# EAGLE design Apple1 (EAGLE 9.2.0)
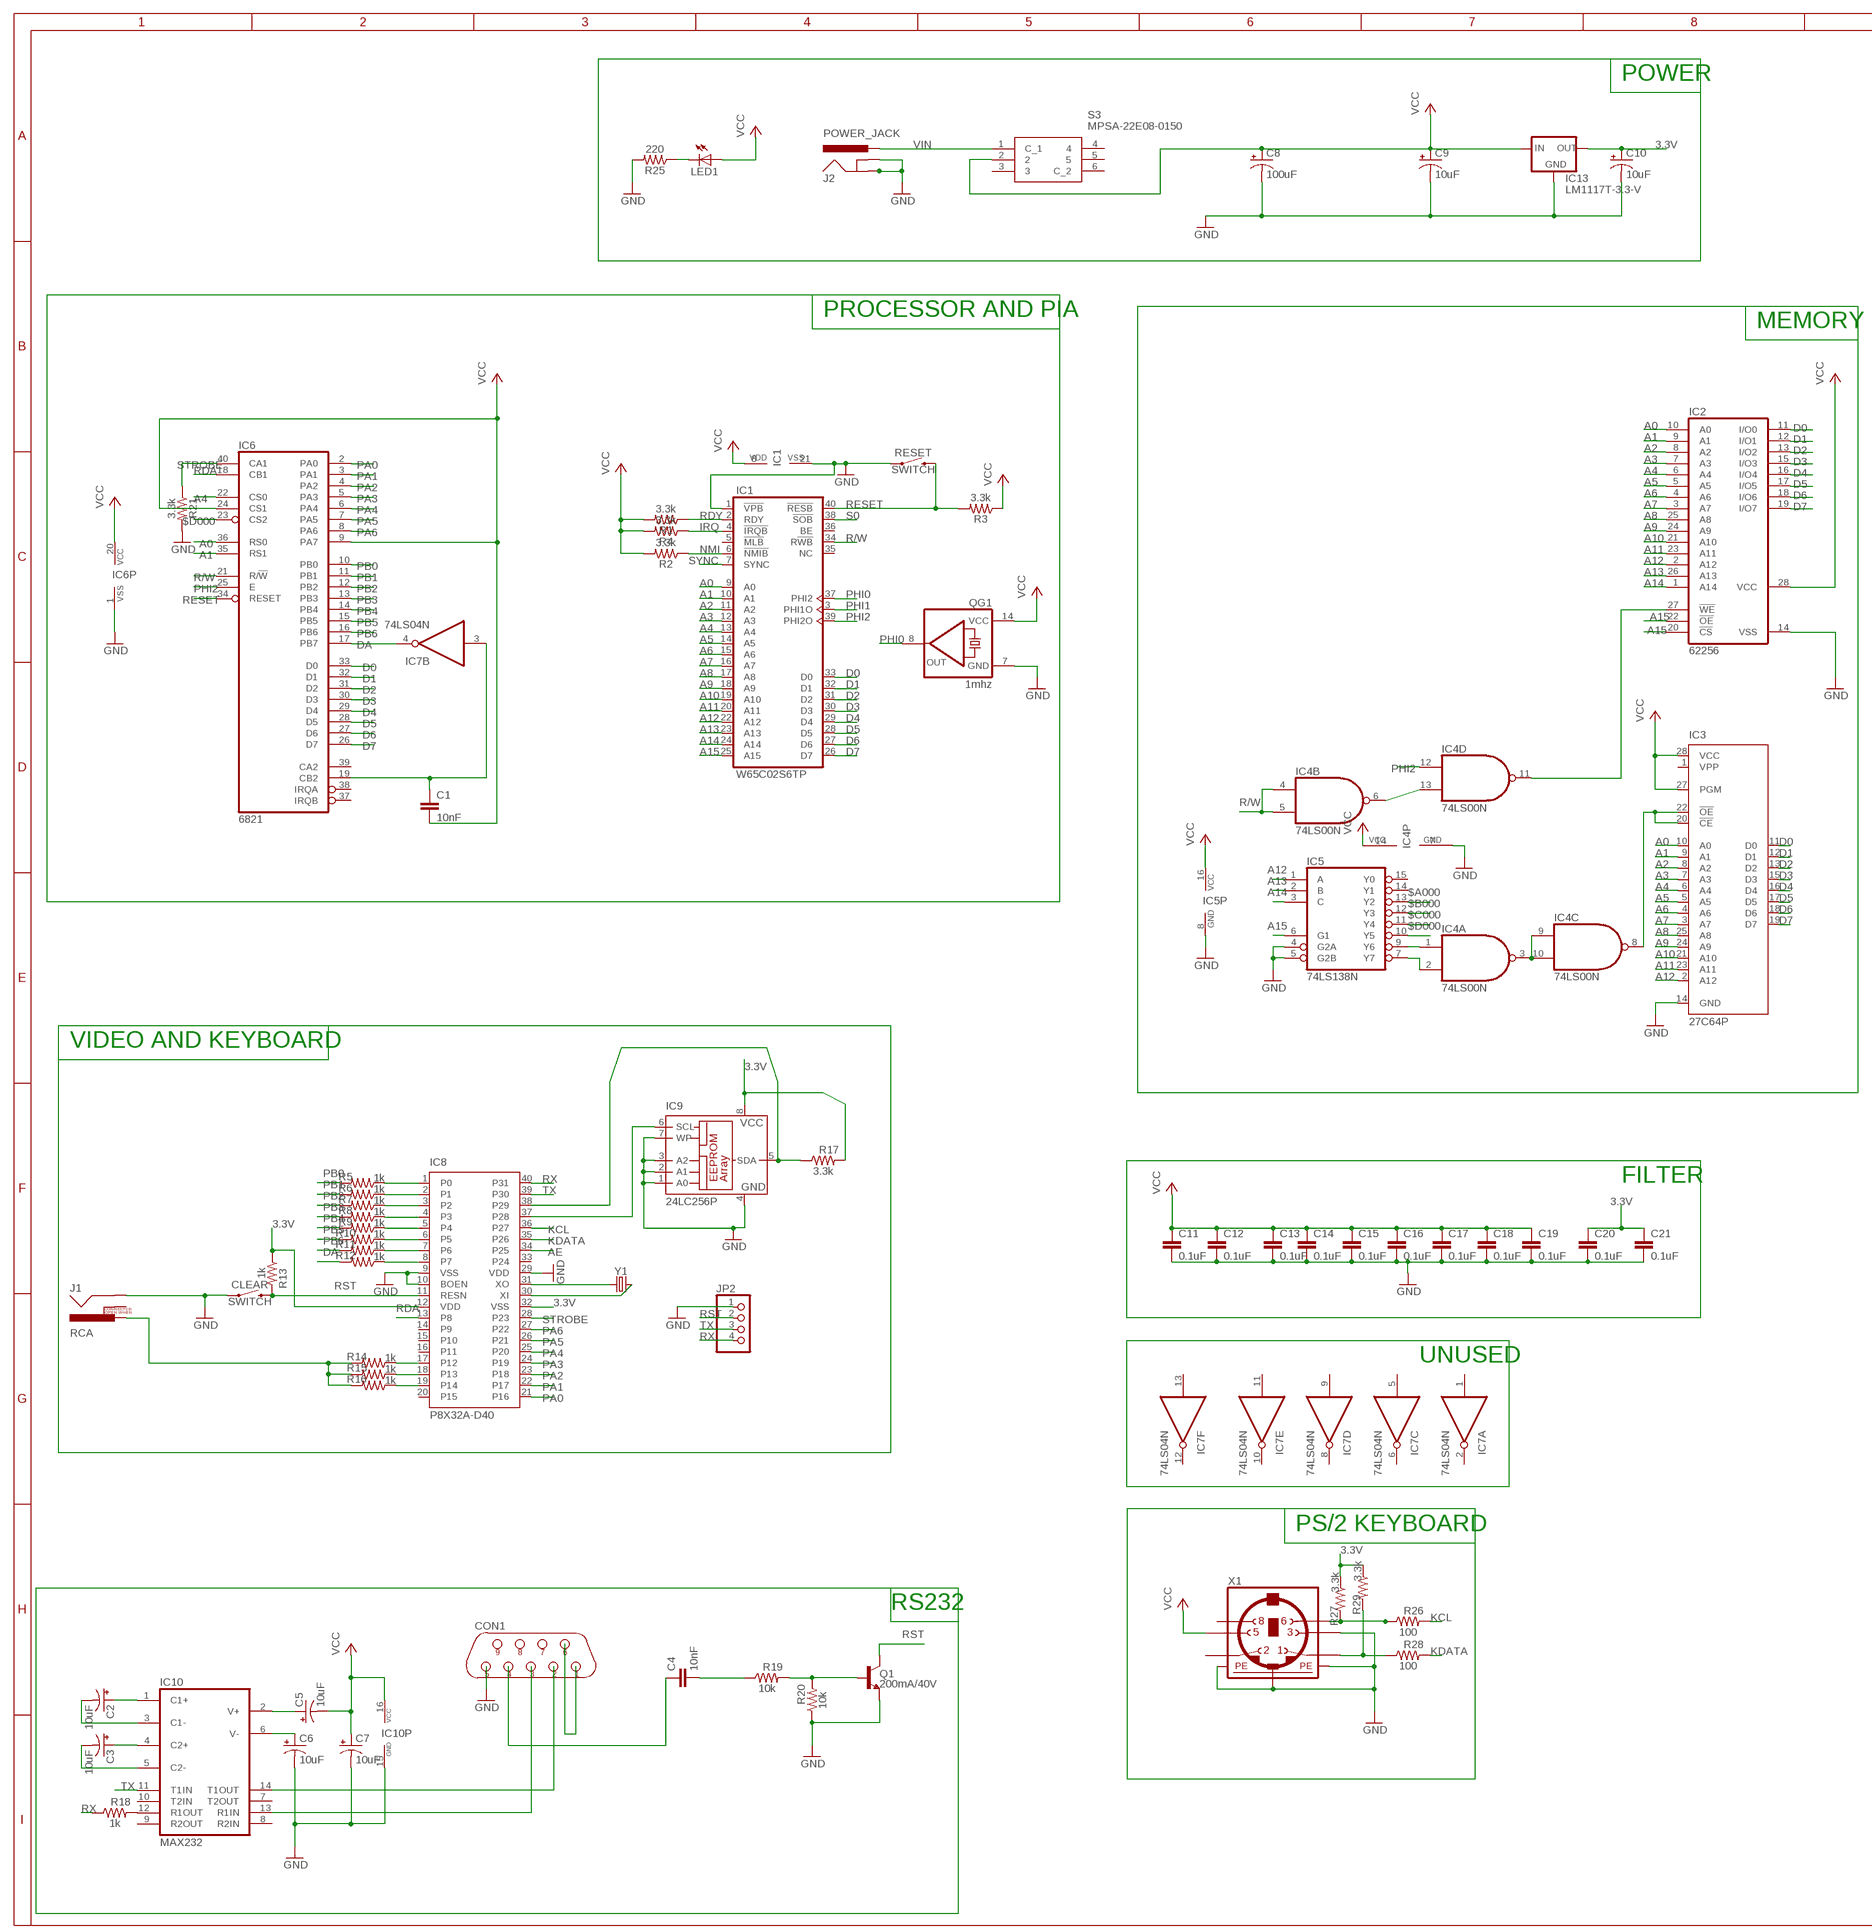
[diagram p0: schematic, sheet 1, part 1 of 2]
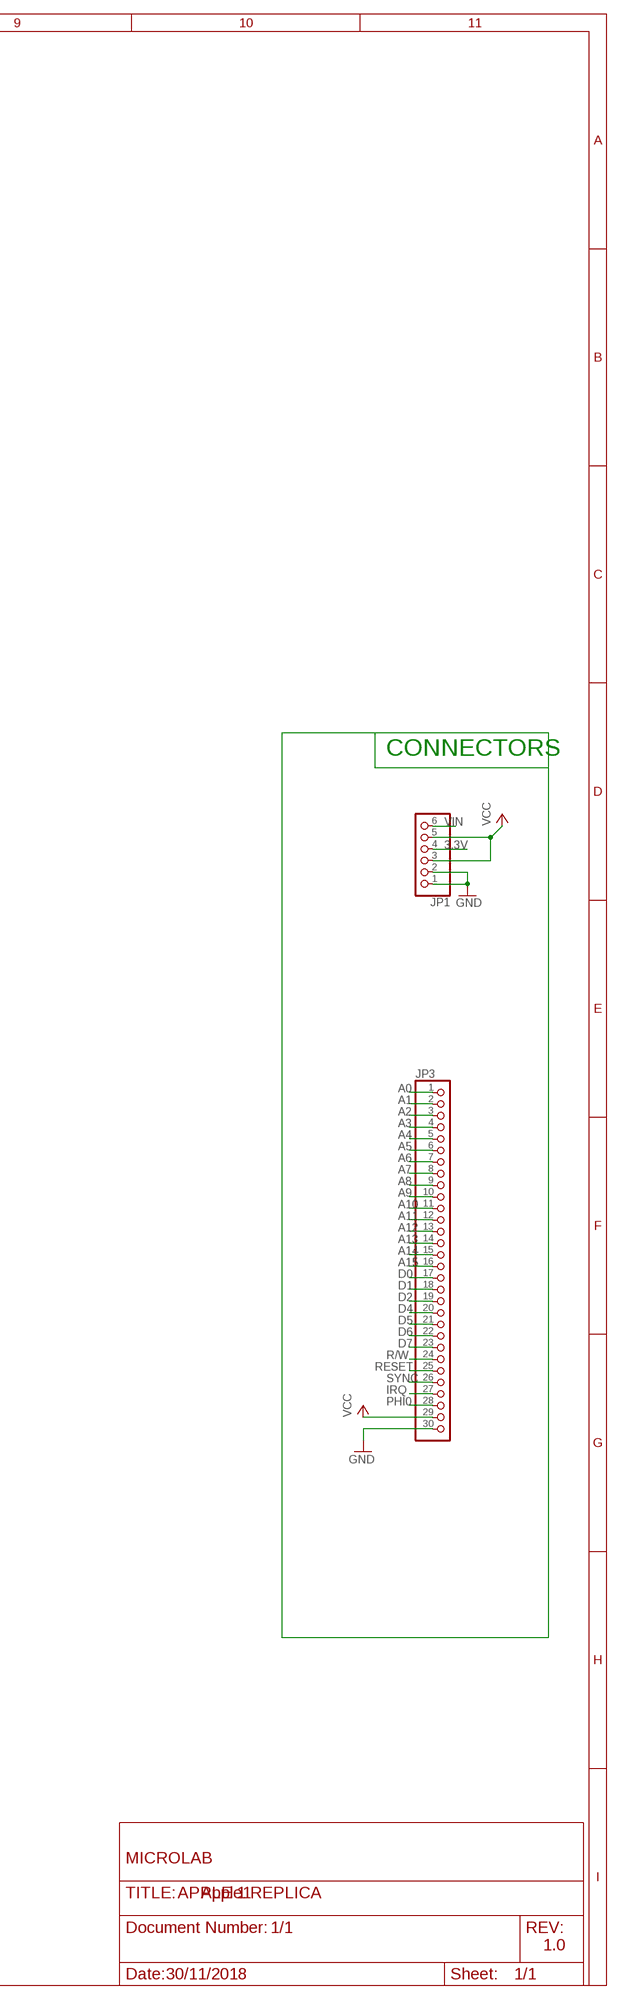
[diagram p1: schematic, sheet 1, part 2 of 2]

## Parts
C1  10nF  10NF-PTH-10MM-10000V-1-%  [CAP-PTH-10MM]
C2  10uF  10UF-POLAR-RADIAL-2.5MM-25V-20%  [CPOL-RADIAL-2.5MM-5MM]
C3  10uF  10UF-POLAR-RADIAL-2.5MM-25V-20%  [CPOL-RADIAL-2.5MM-5MM]
C4  10nF  10NF-PTH-10MM-10000V-1-%  [CAP-PTH-10MM]
C5  10uF  10UF-POLAR-RADIAL-2.5MM-25V-20%  [CPOL-RADIAL-2.5MM-5MM]
C6  10uF  10UF-POLAR-RADIAL-2.5MM-25V-20%  [CPOL-RADIAL-2.5MM-5MM]
C7  10uF  10UF-POLAR-RADIAL-2.5MM-25V-20%  [CPOL-RADIAL-2.5MM-5MM]
C8  100uF  100UF-POLAR-RADIAL-2.5MM-25V-20%  [CPOL-RADIAL-2.5MM-6.5MM]
C9  10uF  10UF-POLAR-RADIAL-2.5MM-25V-20%  [CPOL-RADIAL-2.5MM-5MM]
C10  10uF  10UF-POLAR-RADIAL-2.5MM-25V-20%  [CPOL-RADIAL-2.5MM-5MM]
C11  0.1uF  0.1UF-KIT-EZ-50V-20%  [CAP-PTH-SMALL-KIT]
C12  0.1uF  0.1UF-KIT-EZ-50V-20%  [CAP-PTH-SMALL-KIT]
C13  0.1uF  0.1UF-KIT-EZ-50V-20%  [CAP-PTH-SMALL-KIT]
C14  0.1uF  0.1UF-KIT-EZ-50V-20%  [CAP-PTH-SMALL-KIT]
C15  0.1uF  0.1UF-KIT-EZ-50V-20%  [CAP-PTH-SMALL-KIT]
C16  0.1uF  0.1UF-KIT-EZ-50V-20%  [CAP-PTH-SMALL-KIT]
C17  0.1uF  0.1UF-KIT-EZ-50V-20%  [CAP-PTH-SMALL-KIT]
C18  0.1uF  0.1UF-KIT-EZ-50V-20%  [CAP-PTH-SMALL-KIT]
C19  0.1uF  0.1UF-KIT-EZ-50V-20%  [CAP-PTH-SMALL-KIT]
C20  0.1uF  0.1UF-KIT-EZ-50V-20%  [CAP-PTH-SMALL-KIT]
C21  0.1uF  0.1UF-KIT-EZ-50V-20%  [CAP-PTH-SMALL-KIT]
CLEAR  SWITCH  MOMENTARY-SWITCH-SPST-PTH-6.0MM  [TACTILE_SWITCH_PTH_6.0MM]
CON1  DB9F  [D-09F]
IC1  W65C02S6TP  [DIL40]
IC2  62256  62256P  [DIL28-6]
IC3  27C64P  [DIL28-6]
IC4  74LS00N  [DIL14]
IC5  74LS138N  [DIL16]
IC6  6821  [DIL40]
IC7  74LS04N  [DIL14]
IC8  P8X32A-D40  [DIL40]
IC9  24LC256P  [DIL8]
IC10  MAX232  [DIL16]
IC13  LM1117T-3.3-V  [TO220V]
J1  RCA  [RCA]
J2  POWER_JACK  [POWER_JACK_PTH]
JP1  PINHD-1X6B  [1X06-BIG]
JP2  PINHD-1X4  [1X04]
JP3  PINHD-1X30  [1X30]
LED1  LED5MM  [LED5MM]
Q1  200mA/40V  TRANS_NPN-2N3904  [TO-92]
QG1  1mhz  QG5860  [DIL14S]
R1  3.3k  10KOHM-HORIZ-1/4W-5%  [AXIAL-0.3]
R2  3.3k  10KOHM-HORIZ-1/4W-5%  [AXIAL-0.3]
R3  3.3k  10KOHM-HORIZ-1/4W-5%  [AXIAL-0.3]
R4  3.3k  10KOHM-HORIZ-1/4W-5%  [AXIAL-0.3]
R5  1k  10KOHM-HORIZ-1/4W-5%  [AXIAL-0.3]
R6  1k  10KOHM-HORIZ-1/4W-5%  [AXIAL-0.3]
R7  1k  10KOHM-HORIZ-1/4W-5%  [AXIAL-0.3]
R8  1k  10KOHM-HORIZ-1/4W-5%  [AXIAL-0.3]
R9  1k  10KOHM-HORIZ-1/4W-5%  [AXIAL-0.3]
R10  1k  10KOHM-HORIZ-1/4W-5%  [AXIAL-0.3]
R11  1k  10KOHM-HORIZ-1/4W-5%  [AXIAL-0.3]
R12  1k  10KOHM-HORIZ-1/4W-5%  [AXIAL-0.3]
R13  1k  10KOHM-HORIZ-1/4W-5%  [AXIAL-0.3]
R14  1k  10KOHM-HORIZ-1/4W-5%  [AXIAL-0.3]
R15  1k  10KOHM-HORIZ-1/4W-5%  [AXIAL-0.3]
R16  1k  10KOHM-HORIZ-1/4W-5%  [AXIAL-0.3]
R17  3.3k  10KOHM-HORIZ-1/4W-5%  [AXIAL-0.3]
R18  1k  10KOHM-HORIZ-1/4W-5%  [AXIAL-0.3]
R19  10k  10KOHM-HORIZ-1/4W-5%  [AXIAL-0.3]
R20  10k  10KOHM-HORIZ-1/4W-5%  [AXIAL-0.3]
R21  3.3k  10KOHM-HORIZ-1/4W-5%  [AXIAL-0.3]
R25  220  10KOHM-HORIZ-1/4W-5%  [AXIAL-0.3]
R26  100  10KOHM-HORIZ-1/4W-5%  [AXIAL-0.3]
R27  3.3k  10KOHM-HORIZ-1/4W-5%  [AXIAL-0.3]
R28  100  10KOHM-HORIZ-1/4W-5%  [AXIAL-0.3]
R29  3.3k  10KOHM-HORIZ-1/4W-5%  [AXIAL-0.3]
RESET  SWITCH  MOMENTARY-SWITCH-SPST-PTH-6.0MM  [TACTILE_SWITCH_PTH_6.0MM]
S3  MPSA-22E08-0150  [MPSA22E080150]
X1  MINI_DIN_6  [M_DIN6]
Y1  CRYSTALPTH-HC49UV  [HC49U]

## Nets
3.3V [power]: C10.1(+) C20.1 C21.1 IC8.12(VDD) IC8.32(VSS) IC9.8(VCC) IC13.2(OUT) JP1.4 R13.P$1 R17.P$2 R27.P$1 R29.P$1
$A000: IC5.13(Y2)
$B000: IC5.12(Y3)
$C000: IC5.11(Y4)
$D000: IC5.10(Y5) IC6.23(CS2)
A0: IC1.9(1:A0) IC2.10(A0) IC3.10(A0) IC6.36(RS0) JP3.1
A1: IC1.10(1:A1) IC2.9(A1) IC3.9(A1) IC6.35(RS1) JP3.2
A2: IC1.11(1:A2) IC2.8(A2) IC3.8(A2) JP3.3
A3: IC1.12(1:A3) IC2.7(A3) IC3.7(A3) JP3.4
A4: IC1.13(1:A4) IC2.6(A4) IC3.6(A4) IC6.22(CS0) JP3.5
A5: IC1.14(1:A5) IC2.5(A5) IC3.5(A5) JP3.6
A6: IC1.15(1:A6) IC2.4(A6) IC3.4(A6) JP3.7
A7: IC1.16(1:A7) IC2.3(A7) IC3.3(A7) JP3.8
A8: IC1.17(1:A8) IC2.25(A8) IC3.25(A8) JP3.9
A9: IC1.18(1:A9) IC2.24(A9) IC3.24(A9) JP3.10
A10: IC1.19(1:A10) IC2.21(A10) IC3.21(A10) JP3.11
A11: IC1.20(1:A11) IC2.23(A11) IC3.23(A11) JP3.12
A12: IC1.22(1:A12) IC2.2(A12) IC3.2(A12) IC5.1(A) JP3.13
A13: IC1.23(1:A13) IC2.26(A13) IC5.2(B) JP3.14
A14: IC1.24(1:A14) IC2.1(A14) IC5.3(C) JP3.15
A15: IC1.25(1:A15) IC2.20(!CS) IC2.22(!OE) IC5.6(G1) JP3.16
AE: IC8.34(P25)
D0: IC1.33(1:D0) IC2.11(I/O0) IC3.11(D0) IC6.33(D0) JP3.17
D1: IC1.32(1:D1) IC2.12(I/O1) IC3.12(D1) IC6.32(D1) JP3.18
D2: IC1.31(1:D2) IC2.13(I/O2) IC3.13(D2) IC6.31(D2) JP3.19
D3: IC1.30(1:D3) IC2.15(I/O3) IC3.15(D3) IC6.30(D3)
D4: IC1.29(1:D4) IC2.16(I/O4) IC3.16(D4) IC6.29(D4) JP3.20
D5: IC1.28(1:D5) IC2.17(I/O5) IC3.17(D5) IC6.28(D5) JP3.21
D6: IC1.27(1:D6) IC2.18(I/O6) IC3.18(D6) IC6.27(D6) JP3.22
D7: IC1.26(1:D7) IC2.19(I/O7) IC3.19(D7) IC6.26(D7) JP3.23
DA: IC6.17(PB7) IC7.4(B:O) R12.P$2
GND [power]: C6.2(-) C7.2(-) C8.2(-) C9.2(-) C10.2(-) C11.2 C12.2 C13.2 C14.2 C15.2 C16.2 C17.2 C18.2 C19.2 C20.2 C21.2 CLEAR.1 CON1.5 IC1.1(1:!VPB) IC1.21(P:VSS) IC2.14(VSS) IC3.14(GND) IC4.7(P:GND) IC5.4(G2A) IC5.5(G2B) IC5.8(GND) IC6.1(VSS) IC8.9(VSS) IC8.10(BOEN) IC8.29(VDD) IC9.1(A0) IC9.2(A1) IC9.3(A2) IC9.4(GND) IC9.7(WP) IC10.15(GND) IC13.1(GND) J1.SHELL J2.GND J2.GNDBREAK JP1.1 JP1.2 JP2.1 JP3.30 Q1.1(E) QG1.7(GND) R20.P$1 R21.P$2 R25.P$2 RESET.1 X1.3 X1.SH1(PE1) X1.SH2(PE2) X1.SH3(PE3)
IRQ: IC1.4(1:!IRQB) JP3.27 R4.P$1
KCL: IC8.36(P27) R26.P$2
KDATA: IC8.35(P26) R28.P$2
N$1: IC2.27(!WE) IC4.11(D:O)
N$2: IC4.3(A:O) IC4.9(C:I0) IC4.10(C:I1)
N$3: IC3.20(!CE) IC3.22(!OE) IC4.8(C:O)
N$4: IC4.1(A:I0) IC5.9(Y6)
N$5: IC4.2(A:I1) IC5.7(Y7)
N$6: IC4.6(B:O) IC4.13(D:I1)
N$7: C1.1 IC6.19(CB2) IC7.3(B:I)
N$8: IC8.1(P0) R5.P$1
N$9: IC8.2(P1) R6.P$1
N$10: IC8.3(P2) R7.P$1
N$11: IC8.4(P3) R8.P$1
N$12: IC8.5(P4) R9.P$1
N$13: IC8.6(P5) R10.P$1
N$14: IC8.7(P6) R11.P$1
N$15: IC8.8(P7) R12.P$1
N$16: IC8.17(P12) R14.P$1
N$17: IC8.18(P13) R15.P$1
N$18: IC8.19(P14) R16.P$1
N$19: J1.PIN R14.P$2 R15.P$2 R16.P$2
N$20: IC8.31(XO) Y1.1
N$21: IC8.30(XI) Y1.2
N$22: IC10.12(R1OUT) R18.P$2
N$23: IC8.37(P28) IC9.6(SCL)
N$24: IC8.38(P29) IC9.5(SDA) R17.P$1
N$25: CON1.3 IC10.13(R1IN)
N$26: C2.1(+) IC10.1(C1+)
N$27: C2.2(-) IC10.3(C1-)
N$28: C3.1(+) IC10.4(C2+)
N$29: C3.2(-) IC10.5(C2-)
N$30: CON1.2 IC10.14(T1OUT)
N$31: CON1.1 CON1.6
N$32: C4.1 CON1.4
N$33: C4.2 R19.P$1
N$34: Q1.2(B) R19.P$2 R20.P$2
N$35: C5.1(+) IC10.2(V+)
N$36: C6.1(+) IC10.6(V-)
N$41: LED1.K(C) R25.P$1
N$42: R26.P$1 R27.P$2 X1.6
N$44: R28.P$1 R29.P$2 X1.1
NMI: IC1.6(1:!NMIB) R2.P$1
PA0: IC6.2(PA0) IC8.21(P16)
PA1: IC6.3(PA1) IC8.22(P17)
PA2: IC6.4(PA2) IC8.23(P18)
PA3: IC6.5(PA3) IC8.24(P19)
PA4: IC6.6(PA4) IC8.25(P20)
PA5: IC6.7(PA5) IC8.26(P21)
PA6: IC6.8(PA6) IC8.27(P22)
PB0: IC6.10(PB0) R5.P$2
PB1: IC6.11(PB1) R6.P$2
PB2: IC6.12(PB2) R7.P$2
PB3: IC6.13(PB3) R8.P$2
PB4: IC6.14(PB4) R9.P$2
PB5: IC6.15(PB5) R10.P$2
PB6: IC6.16(PB6) R11.P$2
PHI0: IC1.37(1:PHI2) JP3.28 QG1.8(OUT)
PHI1: IC1.3(1:PHI1O)
PHI2: IC1.39(1:PHI2O) IC4.12(D:I0) IC6.25(E)
R/W: IC1.34(1:R!WB) IC4.4(B:I0) IC4.5(B:I1) IC6.21(R/!W) JP3.24
RDA: IC6.18(CB1) IC8.13(P8)
RDY: IC1.2(1:RDY) R1.P$1
RESET: IC1.40(1:!RESB) IC6.34(RESET) JP3.25 R3.P$2 RESET.3
RST: CLEAR.3 IC8.11(RESN) JP2.2 Q1.3(C) R13.P$2
RX: IC8.40(P31) JP2.4 R18.P$1
S0: IC1.38(1:!SOB)
STROBE: IC6.40(CA1) IC8.28(P23) R21.P$1
SYNC: IC1.7(1:SYNC) JP3.26
TX: IC8.39(P30) IC10.11(T1IN) JP2.3
VCC [power]: C1.2 C5.2(-) C7.1(+) C8.1(+) C9.1(+) C11.1 C12.1 C13.1 C14.1 C15.1 C16.1 C17.1 C18.1 C19.1 IC1.8(P:VDD) IC2.28(VCC) IC3.27(PGM) IC3.28(VCC) IC4.14(P:VCC) IC5.16(VCC) IC6.9(PA7) IC6.20(VCC) IC6.24(CS1) IC10.16(VCC) IC13.3(IN) JP1.3 JP1.5 JP3.29 LED1.A QG1.14(VCC) R1.P$2 R2.P$2 R3.P$1 R4.P$2 S3.2 X1.5
VIN [power]: J2.PWR JP1.6 S3.1(C_1)
Unconnected: CON1.7 CON1.8 CON1.9 IC1.5(1:!MLB) IC1.35(1:NC) IC1.36(1:BE) IC3.1(VPP) IC3.26(NC) IC5.14(Y1) IC5.15(Y0) IC6.37(IRQB) IC6.38(IRQA) IC6.39(CA2) IC7.1(A:I) IC7.2(A:O) IC7.5(C:I) IC7.6(C:O) IC7.8(D:O) IC7.9(D:I) IC7.10(E:O) IC7.11(E:I) IC7.12(F:O) IC7.13(F:I) IC8.14(P9) IC8.15(P10) IC8.16(P11) IC8.20(P15) IC8.33(P24) IC10.7(T2OUT) IC10.8(R2IN) IC10.9(R2OUT) IC10.10(T2IN) J1.SWITCH S3.3 S3.4 S3.5 S3.6(C_2) X1.2 X1.8

## Notes on the sheet
- POWER
- PROCESSOR AND PIA
- MEMORY
- CONNECTORS
- VIDEO AND KEYBOARD
- FILTER
- UNUSED
- PS/2 KEYBOARD
- RS232
- MICROLAB
- APPLE 1 REPLICA
- 1/1
- 1.0
- 30/11/2018

## Power pins joined to a net without a drawn wire
GND: IC7.7(P:GND)
VCC: IC7.14(P:VCC)

## Library data of the parts
C1 C4 = SparkFun-Capacitors:10NF: 0.01uF/10nF/10,000pF ceramic capacitors A capacitor is a passive two-terminal electrical component used to store electrical energy temporarily in an electric field. CAP-09321; PROD_ID: CAP-09321
C2 C3 C5-C7 C9 C10 = SparkFun-Capacitors:10UF-POLAR: 10.0µF polarized capacitors A capacitor is a passive two-terminal electrical component used to store electrical energy temporarily in an electric field.; PROD_ID: CAP-08440
C8 = SparkFun-Capacitors:100UF-POLAR: 100µF polarized capacitors A capacitor is a passive two-terminal electrical component used to store electrical energy temporarily in an electric field.; PROD_ID: CAP-08439
C11-C21 = SparkFun-Capacitors:0.1UF: 0.1µF ceramic capacitors A capacitor is a passive two-terminal electrical component used to store electrical energy temporarily in an electric field.; PROD_ID: CAP-08370
CLEAR RESET = SparkFun-Switches:MOMENTARY-SWITCH-SPST: Momentary Switch (Pushbutton) - SPST Normally-open (NO) SPST momentary switches (buttons, pushbuttons). Variants PTH-12MM - 12mm square, through-hole Momentary Pushbutton Switch - 12mm Square (COM-09190) PTH-6.0MM, PTH-6.0MM-KIT - 6.0mm square, through-hole Mini Pushbutton Switch (COM-00097) KIT package intended for soldering kit's - only one side of pads' copper is exposed. PTH-RIGHT-ANGLE-KIT - Right-angle, through-hole Right Angle Tactile Button - Used on SparkFun BigTime Watch Kit SMD-12MM - 12mm square, surface-mount Tactile Button - SMD (12mm) (COM-12993) Used on SparkFun PicoBoard SMD-4.5MM - 4.5mm Square Trackball Switch Used on SparkFun Blackberry Trackballer Breakout SMD-4.6MMX2.8MM - 4.60mm x 2.80mm, surface mount Used on SparkFun SAMD21 Mini Breakout SMD-5.2MM, SMD-5.2-REDUNDANT - 5.2mm square, surface-mount Mini Pushbutton Switch - SMD (COM-08720) Used on Arduino Pro Mini REDUNDANT package connects both switch circuits together SMD-6.0X3.5MM - 6.0 x 3.5mm, surface mount Momentary Reset Switch SMD (COM-08229) SMD-6.2MM-TALL - 6.2mm square, surface mount Tactile Button - SMD (6mm) Used on SparkFun Digital Sandbox SMD-RIGHT-ANGLE - Right-angle, surface mount Used on SparkFun Block for Intel® Edison - Arduino; PROD_ID: SWCH-08441; SF_SKU: COM-00097
CON1 = connect:DB9F
IC1 = 6502:W65C02S: W65C02 by WDC
IC2 = memory-hitachi:62256P: MEMORY; OC_FARNELL: unknown; OC_NEWARK: unknown
IC3 = microchip:27*64: CMOS EPROM 64 K (8 K x 8), low voltage; MF: Arrow Electronics; MPN: M27C64A-10F1; OC_FARNELL: 1094265; OC_NEWARK: 93K7339
IC4 = 74xx-us:74*00: Quad 2-input NAND gate
IC5 = 74xx-eu:74*138: 3-line to 8-line DECODER/DEMULTIPLEXER
IC6 = micro-motorola:6821: MICROCONTROLLER/MEMORY DEVICE; MF: NTE ELECTRONICS; MPN: NTE6821; OC_FARNELL: 1652403; OC_NEWARK: 29C4772
IC7 = 74xx-us:74*04: Hex INVERTER
IC8 = p8x32a_10:P8X32A-D40: 8-Cog Multiprocessor Microcontroller Source: http://www.parallax.com/sites/default/files/downloads/P8X32A-Propeller-Datasheet-v1.4.0_0.pdf; MF: Parallax Semiconductor; MPN: P8X32A-D40; OC_FARNELL: 1263886; OC_NEWARK: 11X5686
IC9 = microchip:24*: Serial EEPROM I2C; MF: MICROCHIP; MPN: 24LC256-E/P; OC_FARNELL: 9757970; OC_NEWARK: 92C7169
IC10 = maxim:MAX232: RS232 TRANSCEIVER; MF: MAXIM; MPN: MAX232ACPE+; OC_FARNELL: 9723773; OC_NEWARK: 68K4544
IC13 = lm1117:LM1117T-*
J1 = SparkFun-Connectors:RCA: RCA Jack connector This is a right angle RCA jack connecotr. Commonly used for video or audio. Here is the connector we sell at SparkFun: RCA Jack (PRT-08631) Datasheet It is not used on any active designs, however it was used on a couple retired products: RCA Jack Breakout [RETIRED] (PRT-08826) SparkFun On Screen Display Breakout - MAX7456 [RETIRED] (BOB-09168) You may also be interested in a cable: RCA Video Cable - 6' (CAB-11573); PROD_ID: CONN-09081; SF_ID: PRT-08631
J2 = SparkFun-Connectors:POWER_JACK: Power Jack Connector This is the standard 5.5mm barrel jack for power. The PTH is the most common, proven, reliable, footprint. The Slot footprint only works if the mill layer is transmitted to the PCB fab house so be warned. Here are the connectors we sell at SparkFun: DC Barrel Power Jack/Connector (PRT-00119) DC Barrel Power Jack/Connector (SMD) (PRT-12748) DC Barrel Jack Adapter - Breadboard Compatible (PRT-10811) It is used on this SparkFun product (and many, many others): SparkFun RedBoard - Programmed with Arduino (DEV-12757) Also, if you need a mating power supply or connector, please check these out: Wall Adapter Power Supply - 9VDC 650mA (TOL-00298) DC Barrel Jack Adapter - Male (PRT-10287); PROD_ID: CONN-08197
JP1 = adafruit:PINHD-1X6: PIN HEADER
JP2 = pinhead:PINHD-1X4: PIN HEADER
JP3 = pinhead:PINHD-1X30: PIN HEADER
LED1 = led:LED: LED OSRAM: - CHIPLED LG R971, LG N971, LY N971, LG Q971, LY Q971, LO R971, LY R971 LH N974, LH R974 LS Q976, LO Q976, LY Q976 LO Q996 - Hyper CHIPLED LW Q18S LB Q993, LB Q99A, LB R99A - SideLED LS A670, LO A670, LY A670, LG A670, LP A670 LB A673, LV A673, LT A673, LW A673 LH A674 LY A675 LS A676, LA A676, LO A676, LY A676, LW A676 LS A679, LY A679, LG A679 - Hyper Micro SIDELED® LS Y876, LA Y876, LO Y876, LY Y876 LT Y87S - SmartLED LW L88C, LW L88S LB L89C, LB L89S, LG L890 LS L89K, LO L89K, LY L89K LS L896, LA L896, LO L896, LY L896 - TOPLED LS T670, LO T670, LY T670, LG T670, LP T670 LSG T670, LSP T670, LSY T670, LOP T670, LYG T670 LG T671, LOG T671, LSG T671 LB T673, LV T673, LT T673, LW T673 LH T674 LS T676, LA T676, LO T676, LY T676, LB T676, LH T676, LSB T676, LW T676 LB T67C, LV T67C, LT T67C, LS T67K, LO T67K, LY T67K, LW E67C LS E67B, LA E67B, LO E67B, LY E67B, LB E67C, LV E67C, LT E67C LW T67C LS T679, LY T679, LG T679 LS T770, LO T770, LY T770, LG T770, LP T770 LB T773, LV T773, LT T773, LW T773 LH T774 LS E675, LA E675, LY E675, LS T675 LS T776, LA T776, LO T776, LY T776, LB T776 LHGB T686 LT T68C, LB T68C - Hyper Mini TOPLED® LB M676 - Mini TOPLED Santana® LG M470 LS M47K, LO M47K, LY M47K Source: http://www.osram.convergy.de LUXEON: - LUMILED® LXK2-PW12-R00, LXK2-PW12-S00, LXK2-PW14-U00, LXK2-PW14-V00 LXK2-PM12-R00, LXK2-PM12-S00, LXK2-PM14-U00 LXK2-PE12-Q00, LXK2-PE12-R00, LXK2-PE12-S00, LXK2-PE14-T00, LXK2-PE14-U00 LXK2-PB12-K00, LXK2-PB12-L00, LXK2-PB12-M00, LXK2-PB14-N00, LXK2-PB14-P00, LXK2-PB14-Q00 LXK2-PR12-L00, LXK2-PR12-M00, LXK2-PR14-Q00, LXK2-PR14-R00 LXK2-PD12-Q00, LXK2-PD12-R00, LXK2-PD12-S00 LXK2-PH12-R00, LXK2-PH12-S00 LXK2-PL12-P00, LXK2-PL12-Q00, LXK2-PL12-R00 Source: www.luxeon.com KINGBRIGHT: KA-3528ASYC Source: www.kingbright.com
Q1 = SparkFun-DiscreteSemi:TRANS_NPN: NPN transistor Current controlled devices typically used to amplify current or used as a switch. BC547 - COM-08928 (TO-92 45V 100mA) (1.Collector 2.Base 3.Emitter) 2N3904 - COM-00521 (TO-92 40V 200mA) (1.Emitter 2.Base 3.Collector) P2N2222A - COM-12852 (TO-92 40V 600mA) (1.Collector 2.Base 3.Emitter); PROD_ID: TRANS-08447
QG1 = crystal:QG5860: CRYSTAL RESONATOR; OC_FARNELL: unknown; OC_NEWARK: unknown
R1-R18 R21 R25-R29 = SparkFun-Resistors:10KOHM: 10kΩ resistor A resistor is a passive two-terminal electrical component that implements electrical resistance as a circuit element. Resistors act to reduce current flow, and, at the same time, act to lower voltage levels within circuits. - Wikipedia; PROD_ID: RES-09435; VALUE: 10k
R19 R20 = SparkFun-Resistors:10KOHM: 10kΩ resistor A resistor is a passive two-terminal electrical component that implements electrical resistance as a circuit element. Resistors act to reduce current flow, and, at the same time, act to lower voltage levels within circuits. - Wikipedia; PROD_ID: RES-09435
S3 = MPSA-22E08-0150:MPSA-22E08-0150: DPDT Momentary-On Push Button Switch, PCB Source: Datasheet; ARROW_PART_NUMBER: MPSA-22E08-0150; ARROW_PRICE-STOCK: http://uk.rs-online.com/web/p/products/9138895; DESCRIPTION: DPDT Momentary-On Push Button Switch, PCB; HEIGHT: 8mm; MANUFACTURER_NAME: KNITTER-SWITCH; MANUFACTURER_PART_NUMBER: MPSA-22E08-0150; RS_PART_NUMBER: 9138895; RS_PRICE-STOCK: http://uk.rs-online.com/web/p/products/9138895
X1 = mini_din:MINI_DIN_6
Y1 = SparkFun-Clocks:CRYSTAL: Crystals (Generic) These are passive quartz crystals, which can be used as a clock source for a microcontroller. Crystal's are two-terminal devices. They require external "load" capacitors to generate an oscillating signal.

## Net classes
1 power: width 0.762 mm, clearance 0.762 mm

## Board
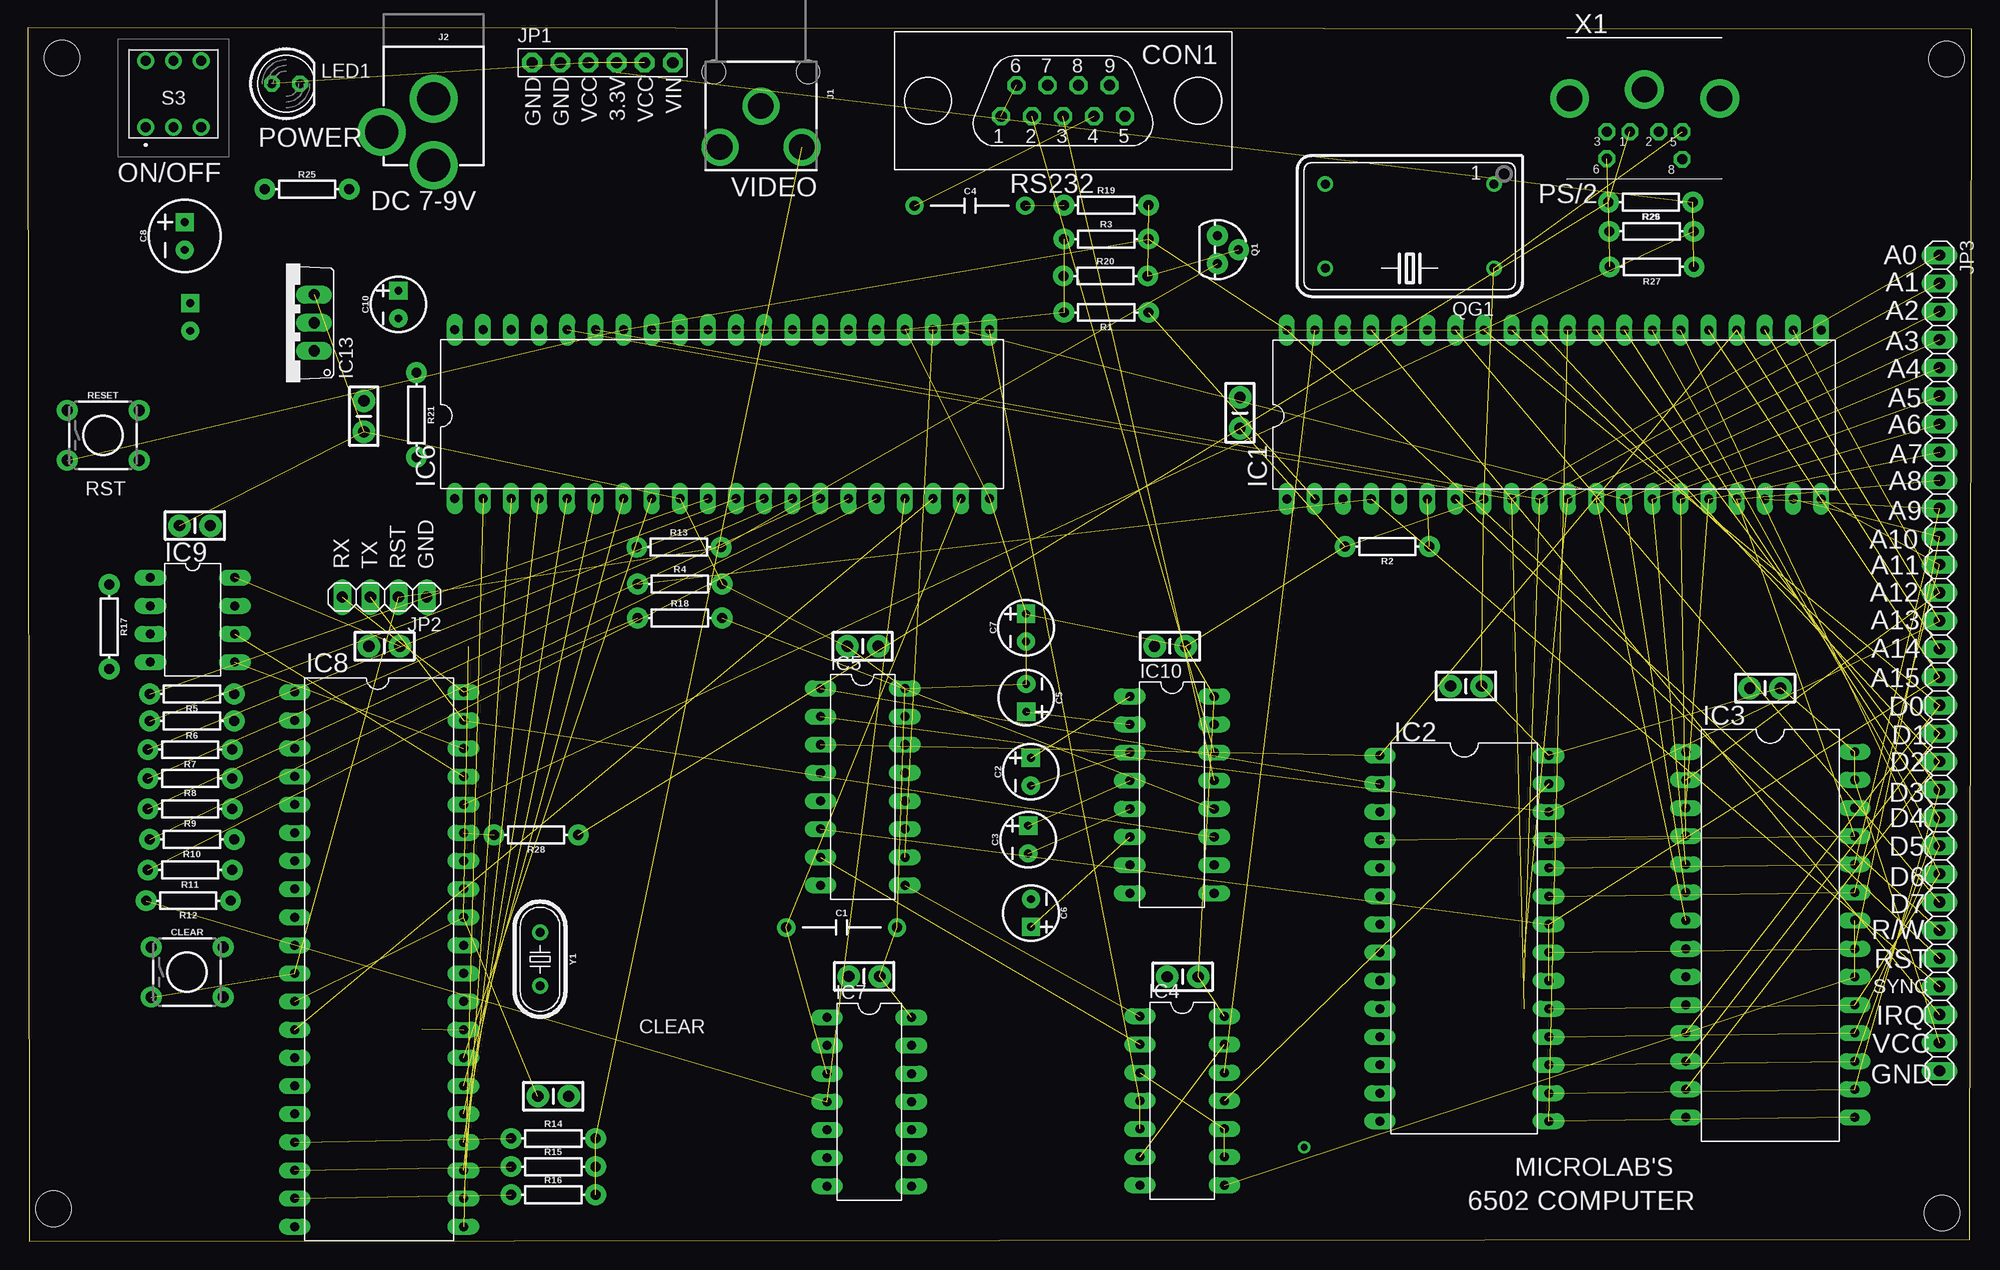
[diagram p2: board, top side]
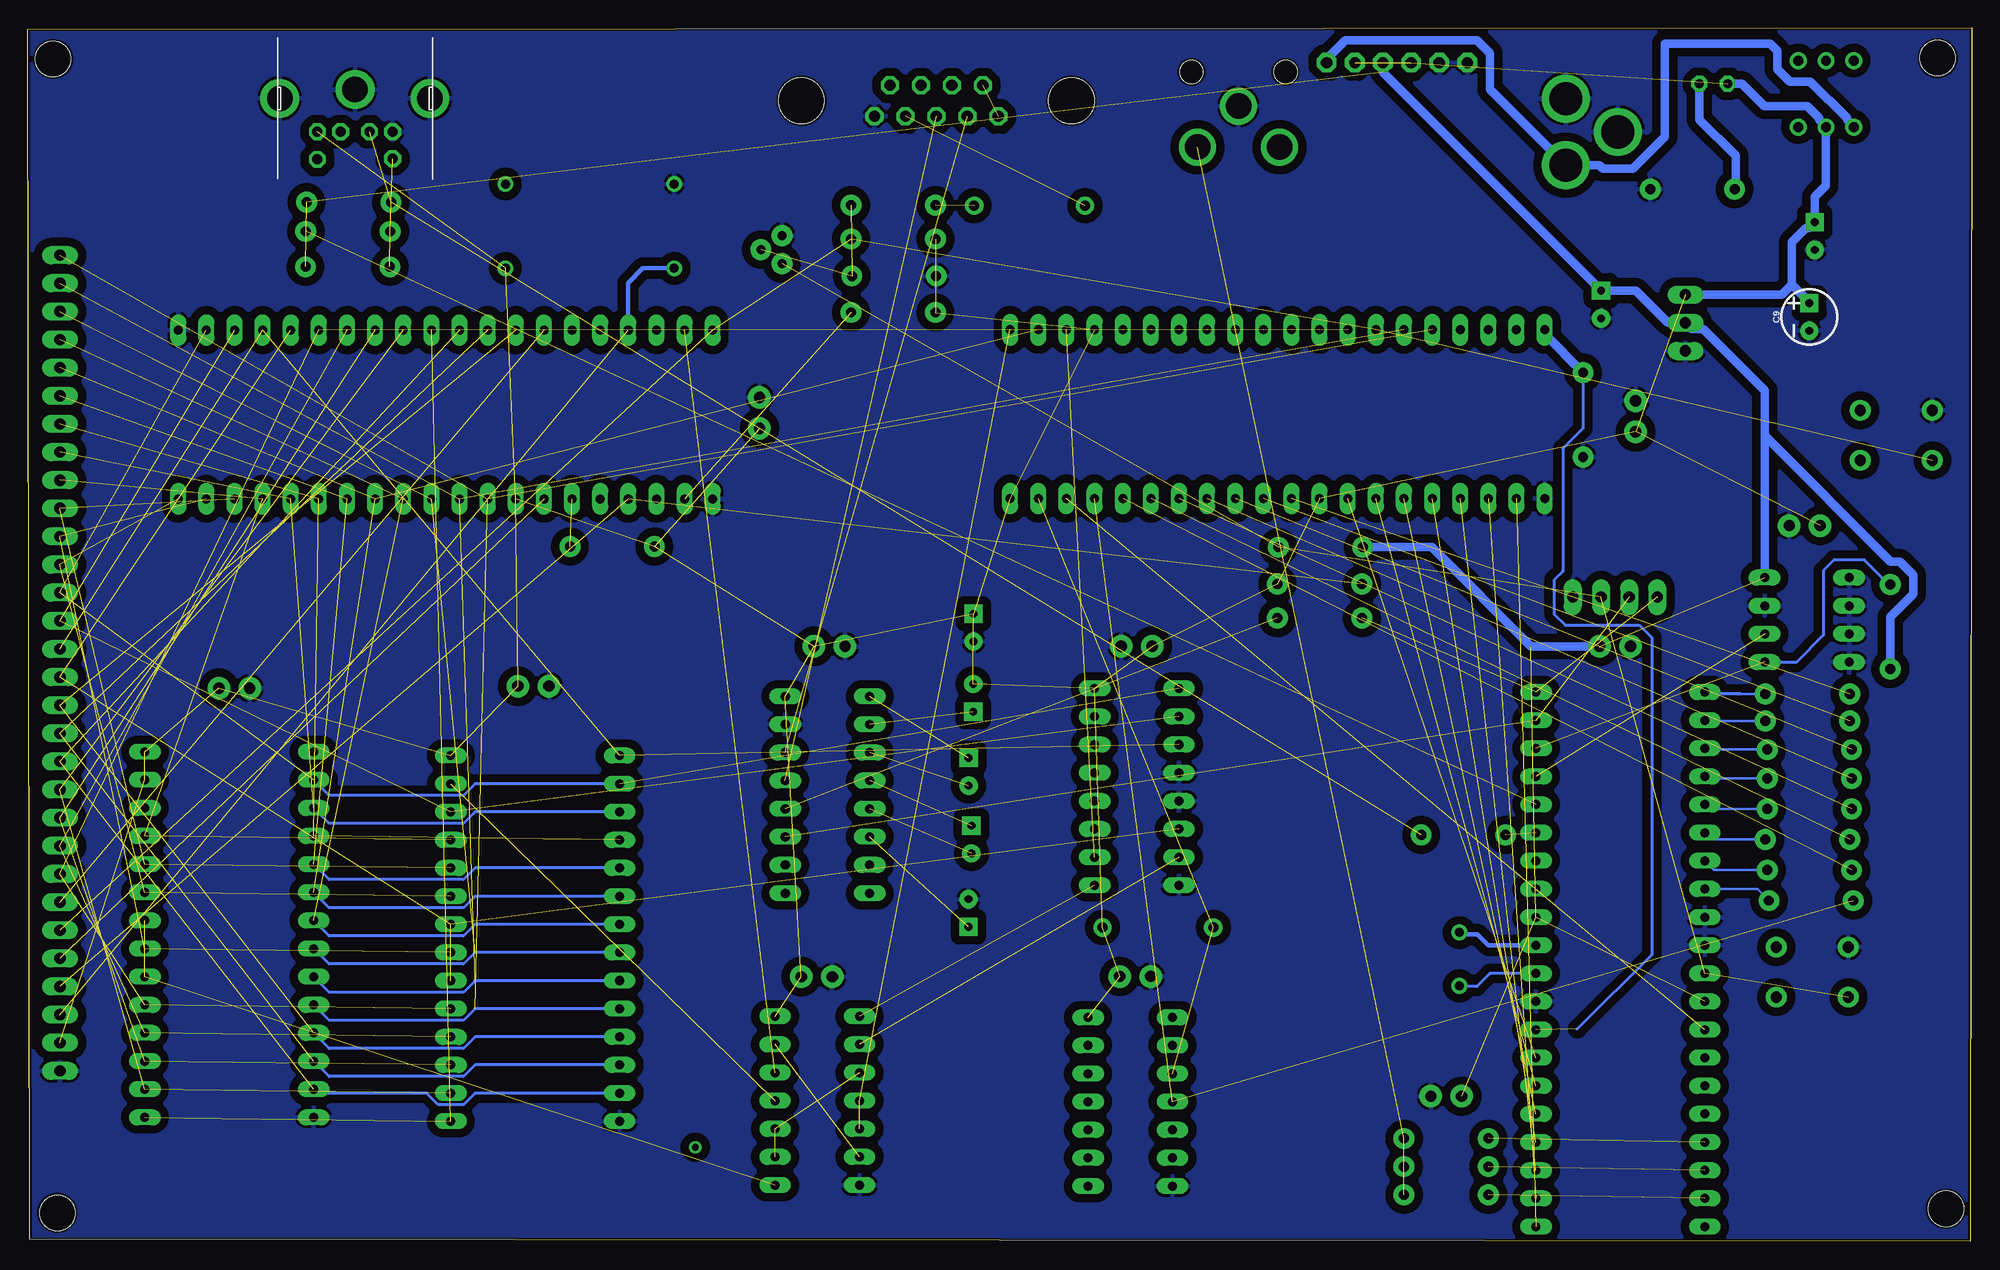
[diagram p3: board, bottom side, seen from below]

Size 175.53 x 109.58 mm. Coordinates in mm from the lower left corner, seen from the top.
Outline: 0.12,0 175.34,0.17 175.53,109.45 0,109.58 0.12,0
Copper layers (1*16): Top 0.035mm / dielectric 1.5mm / Bottom 0.035mm
Design rules "SparkFun *": minimum track width 10mil, minimum drill 20mil, track to track 8mil, track to pad 8mil, pad to pad 8mil, via to via 8mil, smd to smd 8mil, copper to edge 8mil, drill to drill 8mil, minimum pad ring 12mil, minimum via ring 10mil, stop-mask expansion 4mil, vias tented up to drill 20mil, thermal gap 10mil
Holes 3.2 mm at 3.09,106.85 2.34,2.93 173.24,106.76 172.86,2.55

### Footprints (pad centres in the part's own frame; a part is rotated, then mirrored left to right if it is on the bottom)
CAP-PTH-10MM = drill 0.9 pad 1.651: 1 -5,0; 2 5,0
CPOL-RADIAL-2.5MM-5MM = drill 0.7 pad 1.651 square: 1 1.25,0 | drill 0.7 pad 1.651: 2 -1.25,0
CPOL-RADIAL-2.5MM-6.5MM = drill 0.7 pad 1.651 square: 1 1.25,0 | drill 0.7 pad 1.651: 2 -1.25,0
CAP-PTH-SMALL-KIT = drill 1.016 pad 2.032: 1 -1.397,0; 2 1.397,0
TACTILE_SWITCH_PTH_6.0MM = drill 1.016 pad 1.88: 1 -3.251,2.261; 2 3.251,2.261; 3 -3.251,-2.261; 4 3.251,-2.261
D-09F = drill 1.016 pad 1.575 octagon: 1 5.588,1.397; 2 2.794,1.397; 3 0,1.397; 4 -2.794,1.397; 5 -5.588,1.397; 6 4.191,-1.397; 7 1.397,-1.397; 8 -1.397,-1.397; 9 -4.191,-1.397 | hole 4.115: 12.192,0; -12.192,0
DIL40 = drill 0.813 long: 1 -24.13,-7.62; 2 -21.59,-7.62; 3 -19.05,-7.62; 4 -16.51,-7.62; 5 -13.97,-7.62; 6 -11.43,-7.62; 7 -8.89,-7.62; 8 -6.35,-7.62; 9 -3.81,-7.62; 10 -1.27,-7.62; 11 1.27,-7.62; 12 3.81,-7.62; 13 6.35,-7.62; 14 8.89,-7.62; 15 11.43,-7.62; 16 13.97,-7.62; 17 16.51,-7.62; 18 19.05,-7.62; 19 21.59,-7.62; 20 24.13,-7.62; 21 24.13,7.62; 22 21.59,7.62; 23 19.05,7.62; 24 16.51,7.62; 25 13.97,7.62; 26 11.43,7.62; 27 8.89,7.62; 28 6.35,7.62; 29 3.81,7.62; 30 1.27,7.62; 31 -1.27,7.62; 32 -3.81,7.62; 33 -6.35,7.62; 34 -8.89,7.62; 35 -11.43,7.62; 36 -13.97,7.62; 37 -16.51,7.62; 38 -19.05,7.62; 39 -21.59,7.62; 40 -24.13,7.62
DIL28-6 = drill 0.813 long: 1 -16.51,-7.62; 2 -13.97,-7.62; 3 -11.43,-7.62; 4 -8.89,-7.62; 5 -6.35,-7.62; 6 -3.81,-7.62; 7 -1.27,-7.62; 8 1.27,-7.62; 9 3.81,-7.62; 10 6.35,-7.62; 11 8.89,-7.62; 12 11.43,-7.62; 13 13.97,-7.62; 14 16.51,-7.62; 15 16.51,7.62; 16 13.97,7.62; 17 11.43,7.62; 18 8.89,7.62; 19 6.35,7.62; 20 3.81,7.62; 21 1.27,7.62; 22 -1.27,7.62; 23 -3.81,7.62; 24 -6.35,7.62; 25 -8.89,7.62; 26 -11.43,7.62; 27 -13.97,7.62; 28 -16.51,7.62
DIL14 = drill 0.813 long: 1 -7.62,-3.81; 2 -5.08,-3.81; 3 -2.54,-3.81; 4 0,-3.81; 5 2.54,-3.81; 6 5.08,-3.81; 7 7.62,-3.81; 8 7.62,3.81; 9 5.08,3.81; 10 2.54,3.81; 11 0,3.81; 12 -2.54,3.81; 13 -5.08,3.81; 14 -7.62,3.81
DIL16 = drill 0.813 long: 1 -8.89,-3.81; 2 -6.35,-3.81; 3 -3.81,-3.81; 4 -1.27,-3.81; 5 1.27,-3.81; 6 3.81,-3.81; 7 6.35,-3.81; 8 8.89,-3.81; 9 8.89,3.81; 10 6.35,3.81; 11 3.81,3.81; 12 1.27,3.81; 13 -1.27,3.81; 14 -3.81,3.81; 15 -6.35,3.81; 16 -8.89,3.81
DIL40' = drill 0.813 long: 1 -22.86,-7.62; 2 -20.32,-7.62; 3 -17.78,-7.62; 4 -15.24,-7.62; 5 -12.7,-7.62; 6 -10.16,-7.62; 7 -7.62,-7.62; 8 -5.08,-7.62; 9 -2.54,-7.62; 10 0,-7.62; 11 2.54,-7.62; 12 5.08,-7.62; 13 7.62,-7.62; 14 10.16,-7.62; 15 12.7,-7.62; 16 15.24,-7.62; 17 17.78,-7.62; 18 20.32,-7.62; 19 22.86,-7.62; 20 25.4,-7.62; 21 25.4,7.62; 22 22.86,7.62; 23 20.32,7.62; 24 17.78,7.62; 25 15.24,7.62; 26 12.7,7.62; 27 10.16,7.62; 28 7.62,7.62; 29 5.08,7.62; 30 2.54,7.62; 31 0,7.62; 32 -2.54,7.62; 33 -5.08,7.62; 34 -7.62,7.62; 35 -10.16,7.62; 36 -12.7,7.62; 37 -15.24,7.62; 38 -17.78,7.62; 39 -20.32,7.62; 40 -22.86,7.62
DIL8 = drill 0.813 long: 1 -3.81,-3.81; 2 -1.27,-3.81; 3 1.27,-3.81; 4 3.81,-3.81; 5 3.81,3.81; 6 1.27,3.81; 7 -1.27,3.81; 8 -3.81,3.81
TO220V = drill 1.016 long: 1 -2.54,-2.54; 2 0,-2.54; 3 2.54,-2.54
RCA = drill 2.3: PIN 3.7,3.7; SHELL 0,0; SWITCH 3.7,-3.7 | hole 2.1: -3.1,4.25; -3.1,-4.25
POWER_JACK_PTH = drill 2.997 pad 4.318: GND 0,7.7; GNDBREAK 4.7,10.7; PWR 0,13.7
1X06-BIG = drill 1.016 pad 1.778 octagon: 1 -6.35,0; 2 -3.81,0; 3 -1.27,0; 4 1.27,0; 5 3.81,0; 6 6.35,0
1X04 = drill 1.016 long: 1 -3.81,0; 2 -1.27,0; 3 1.27,0; 4 3.81,0
1X30 = drill 1.016 long: 1 -36.83,0; 2 -34.29,0; 3 -31.75,0; 4 -29.21,0; 5 -26.67,0; 6 -24.13,0; 7 -21.59,0; 8 -19.05,0; 9 -16.51,0; 10 -13.97,0; 11 -11.43,0; 12 -8.89,0; 13 -6.35,0; 14 -3.81,0; 15 -1.27,0; 16 1.27,0; 17 3.81,0; 18 6.35,0; 19 8.89,0; 20 11.43,0; 21 13.97,0; 22 16.51,0; 23 19.05,0; 24 21.59,0; 25 24.13,0; 26 26.67,0; 27 29.21,0; 28 31.75,0; 29 34.29,0; 30 36.83,0
LED5MM = drill 0.813 octagon: A -1.27,0; K 1.27,0
TO-92 = drill 0.813 pad 1.88: 1 -1.27,0; 2 0,1.905; 3 1.27,0
DIL14S = drill 0.813: 1 -7.62,-3.81; 7 7.62,-3.81; 8 7.62,3.81; 14 -7.62,3.81
AXIAL-0.3 = drill 0.9 pad 1.88: P$1 -3.81,0; P$2 3.81,0
MPSA22E080150 = drill 0.9 pad 1.4: 1 -2.5,-2.65; 2 0,-2.65; 3 2.5,-2.65; 4 -2.5,3.35; 5 0,3.35; 6 2.5,3.35
M_DIN6 = drill 0.9 pad 1.422 octagon: 1 -1.3,-3.75; 2 1.3,-3.75; 3 -3.4,-3.75; 5 3.4,-3.75; 6 -3.4,-6.2; 8 3.4,-6.25 | drill 2.3 pad 3.5: SH1 6.8,-0.75; SH2 0,0.05; SH3 -6.75,-0.75
HC49U = drill 0.813: 1 -2.413,0; 2 2.413,0

### Placement (x,y rotation side)
C1  73.49,28.33 0 top
C2  90.58,42.38 90 top
C3  90.33,36.27 90 top
C4  85.08,93.51 0 top
C5  90.16,49.06 270 top
C6  90.59,29.64 270 top
C7  90.14,55.4 90 top
C8  14.18,90.77 90 top
C9  14.67,83.46 90 bottom
C10  33.47,84.6 90 top
C11  15.09,64.62 0 top
C12  103.14,53.73 180 top
C13  75.39,53.73 0 top
C14  75.53,23.91 180 top
C15  104.29,23.88 180 top
C16  156.88,49.94 180 top
C17  129.87,50.13 180 top
C18  109.45,74.8 90 top
C19  30.35,74.5 90 top
C20  32.21,53.73 180 top
C21  47.45,13.09 0 top
CLEAR  14.39,24.3 0 top
CON1  93.49,102.98 180 top
IC1  137.81,74.66 0 top
IC2  129.7,27.34 270 top
IC3  157.33,27.69 270 top
IC4  104.24,12.69 270 top
IC5  75.39,41.03 270 top
IC6  62.69,74.68 0 top
IC7  75.98,12.59 270 top
IC8  P8X32A-D40  [DIL40']  31.72,26.72 270 top
IC9  14.89,56.1 270 top
IC10  103.32,40.32 270 top
IC13  23.32,82.94 90 top
J1  66.21,102.49 270 top
J2  36.66,110.88 180 top
JP1  51.9,106.43 0 top
JP2  32.21,58.17 180 top
JP3  172.62,52.21 270 top
LED1  23.32,104.53 0 top
Q1  107.43,89.54 270 top
QG1  124.78,91.66 180 top
R1  97.39,83.88 180 top
R2  122.76,62.73 180 top
R3  97.38,90.5 0 top
R4  58.88,59.35 0 top
R5  14.83,49.41 180 top
R6  14.83,46.98 180 top
R7  14.67,44.39 180 top
R8  14.67,41.79 180 top
R9  14.67,39.03 180 top
R10  14.83,36.27 180 top
R11  14.67,33.51 180 top
R12  14.5,30.75 180 top
R13  58.8,62.67 0 top
R14  47.45,9.28 0 top
R15  47.45,6.74 0 top
R16  47.45,4.2 0 top
R17  7.37,55.49 270 top
R18  58.88,56.27 0 top
R19  97.38,93.57 0 top
R20  97.31,87.17 0 top
R21  35.1,74.62 270 top
R25  25.23,95 0 top
R26  146.61,91.19 0 top
R27  146.64,87.99 180 top
R28  45.9,36.69 180 top
R29  146.54,93.83 180 top
RESET  6.81,72.78 0 top
S3  13.16,103.26 0 top
X1  145.98,103.95 0 top
Y1  46.26,25.47 270 top

### Tracks (layer width: path | path; a pad name or v marks a point on that pad's centre or on a via)
3.3V  (6 unrouted)
  Bottom 0.762: 18.7,72.73 18.7,76.81 24.24,82.35 25.28,82.35 IC13.2 27.43,82.94 30.36,85.86 33.46,85.86 C10.1 53.17,105.54 JP1.4 | 18.7,72.73 IC9.8 | R17.P$2 7.37,56.35 5.28,58.44 5.28,60.16 6.5,61.38 7.35,61.38 18.7,72.73 | R13.P$1 48.74,62.67 39.79,53.72 C20.1
$D000  (1 unrouted)
A0  (3 unrouted)
  Bottom 0.254: IC2.10 135.14,20.99 136.18,19.95 148.32,19.95 IC3.10
A1  (3 unrouted)
  Bottom 0.254: IC2.9 135.14,23.53 136.18,22.49 148.32,22.49 IC3.9
A2  (2 unrouted)
  Bottom 0.254: IC2.8 135.14,26.07 136.18,25.03 148.32,25.03 IC3.8
A3  (2 unrouted)
  Bottom 0.254: IC2.7 135.14,28.61 136.18,27.57 148.32,27.57 IC3.7
A4  (3 unrouted)
  Bottom 0.254: IC2.6 135.14,31.15 136.18,30.11 148.32,30.11 IC3.6
A5  (2 unrouted)
  Bottom 0.254: IC2.5 135.14,33.69 136.18,32.65 148.32,32.65 IC3.5
A6  (3 unrouted)
A7  (2 unrouted)
  Bottom 0.254: IC2.3 135.14,38.77 136.18,37.73 148.32,37.73 IC3.3
A8  (3 unrouted)
A9  (3 unrouted)
A10  (3 unrouted)
A11  (3 unrouted)
A12  (3 unrouted)
  Bottom 0.254: IC2.2 135.14,41.31 136.18,40.27 148.32,40.27 IC3.2
A13  (3 unrouted)
A14  (3 unrouted)
A15  (4 unrouted)
D0  (3 unrouted)
  Bottom 0.254: IC2.11 135.14,18.45 136.18,17.41 148.32,17.41 IC3.11
D1  (3 unrouted)
  Bottom 0.254: IC2.12 135.14,15.91 136.18,14.87 148.32,14.87 IC3.12
D2  (3 unrouted)
  Bottom 0.254: IC3.13 149.36,13.37 139.51,13.37 138.47,12.33 136.18,12.33 135.14,13.37 IC2.13
D3  (3 unrouted)
D4  (4 unrouted)
D5  (4 unrouted)
D6  (4 unrouted)
D7  (4 unrouted)
DA  (2 unrouted)
GMD  (via drill 0.6)
  other vias: 115.26,8.48
GND
  pour Bottom: 0.12,0 0.01,0 0.01,109.55 175.35,109.55 175.35,0.11 0.12,0.11 0.12,0.06
IRQ  (2 unrouted)
KCL  (1 unrouted)
KDATA  (1 unrouted)
N$1  (1 unrouted)
N$2  (2 unrouted)
N$3  (2 unrouted)
N$4  (1 unrouted)
N$5  (1 unrouted)
N$6  (1 unrouted)
N$7  (2 unrouted)
N$8
  Bottom 0.203: R5.P$1 20.88,49.41 | 23.93,49.41 IC8.1
  Bottom 0.254: 20.88,49.41 21.08,49.41 | 21.08,49.41 23.93,49.41 | 21.08,49.41 | 21.08,49.41 | 21.08,49.41 | 21.08,49.41
N$9
  Bottom 0.203: R6.P$1 21.21,46.98 24.04,46.98 IC8.2
N$10
  Bottom 0.203: R7.P$1 23.99,44.39 IC8.3
N$11
  Bottom 0.203: R8.P$1 23.93,41.79 IC8.4
N$12
  Bottom 0.203: R9.P$1 23.71,39.03 IC8.5
N$13
  Bottom 0.203: R10.P$1 23.49,36.27 IC8.6
N$14
  Bottom 0.203: R11.P$1 23.27,33.51 IC8.7
N$15
  Bottom 0.203: R12.P$1 19.36,31.8 IC8.8
N$16  (1 unrouted)
N$17  (1 unrouted)
N$18  (1 unrouted)
N$19  (3 unrouted)
N$20
  Bottom 0.406: IC8.31 43.66,26.72 44.64,27.7 46.08,27.7 Y1.1
N$21
  Bottom 0.254: IC8.30 43.49,24.18 44.68,23 46.21,23 Y1.2
N$22  (1 unrouted)
N$23  (1 unrouted)
N$24  (1 unrouted)
  Bottom 0.254: R17.P$1 7.49,59.3 9.71,61.51 12.46,61.51 13.39,60.58 13.39,54.73 15.84,52.28 18.69,52.28 IC9.5
N$25  (1 unrouted)
N$26  (1 unrouted)
N$27  (1 unrouted)
N$28  (1 unrouted)
N$29  (1 unrouted)
N$30  (1 unrouted)
N$31  (1 unrouted)
N$32  (1 unrouted)
N$33  (1 unrouted)
N$34  (2 unrouted)
N$35  (1 unrouted)
N$36  (1 unrouted)
N$41
  Bottom 0.762: LED1.K 24.59,101.27 21.33,98.01 21.33,95.09 R25.P$1
N$42  (2 unrouted)
N$44  (2 unrouted)
NMI  (1 unrouted)
PA0  (1 unrouted)
PA1  (1 unrouted)
PA2  (1 unrouted)
PA3  (1 unrouted)
PA4  (1 unrouted)
PA5  (1 unrouted)
PA6  (1 unrouted)
PB0  (1 unrouted)
PB1  (1 unrouted)
PB2  (1 unrouted)
PB3  (1 unrouted)
PB4  (1 unrouted)
PB5  (1 unrouted)
PB6  (1 unrouted)
PHI0  (1 unrouted)
  Bottom 0.406: QG1.8 120,87.85 121.31,86.54 121.31,82.29 IC1.37
PHI2  (2 unrouted)
R/W  (4 unrouted)
RDA  (1 unrouted)
RDY  (1 unrouted)
RESET  (4 unrouted)
RST  (4 unrouted)
RX  (2 unrouted)
STROBE  (1 unrouted)
  Bottom 0.254: R21.P$1 35.1,73.4 36.92,71.57 36.92,60.49 37.72,59.69 37.72,56.65 36.7,55.63 30.03,55.63 28.91,54.51 28.91,25.87 35.62,19.16
  Bottom 0.762: R21.P$1 38.56,81.9 IC6.40
SYNC  (1 unrouted)
TX  (2 unrouted)
VCC  (32 unrouted)
  Bottom 0.762: 16.25,86.38 16.25,90.23 14.99,91.49 14.71,91.49 C8.1 14.18,94.3 13.16,95.33 S3.2 13.76,101.21 13.76,101.39 14.88,102.5 18.72,102.5 20.74,104.53 LED1.A | 16.25,86.38 14.67,84.81 C9.1 | 16.25,86.38 17.16,85.48 IC13.3
VIN
  Bottom 0.762: S3.1 11.26,101.21 11.26,101.39 14.58,104.71 16.45,104.71 17.56,105.82 17.56,107.5 18.2,108.14 27.73,108.14 27.73,99.74 30.59,96.87 33.32,96.87 33.63,97.18 J2.PWR 43.51,104.03 43.51,107.27 44.7,108.46 56.55,108.46 56.69,108.32 56.71,108.32 58.25,106.78 JP1.6

### Text on the board
tPlace: GND | GND | VCC | 3.3V | VCC | VIN | POWER | ON/OFF | RS232 | VIDEO | PS/2 | DC 7-9V | A0 | A1 | A2 | A3 | A4 | A5 | A6 | A7 | A8 | RST | A9 | A10 | RX | TX | RST | GND | A11 | A12 | A13 | A14 | A15 | D0 | D1 | D2 | D3 | D4 | D5 | D6 | D7 | R/W | RST | SYNC | IRQ | CLEAR | VCC | GND | MICROLAB'S | 6502 COMPUTER